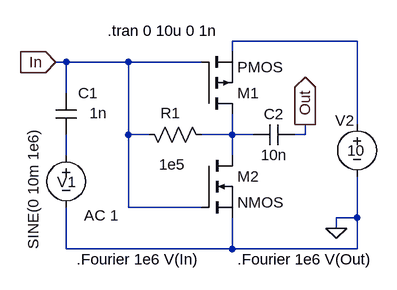
[diagram p0: schematic CmosLinTest_1.asc]
CmosLinTest_1.asc, the LTspice schematic file:
Version 4
SHEET 1 880 680
WIRE -256 80 -272 80
WIRE -256 128 -256 80
WIRE -256 224 -256 192
WIRE -256 368 -256 304
WIRE -160 80 -256 80
WIRE -160 192 -160 80
WIRE -160 304 -160 192
WIRE -128 192 -160 192
WIRE -48 80 -160 80
WIRE -48 304 -160 304
WIRE 0 64 0 48
WIRE 0 192 -48 192
WIRE 0 192 0 160
WIRE 0 224 0 192
WIRE 0 368 -256 368
WIRE 0 368 0 320
WIRE 32 192 0 192
WIRE 112 192 96 192
WIRE 112 192 112 176
WIRE 160 336 160 320
WIRE 192 48 0 48
WIRE 192 176 192 48
WIRE 192 320 160 320
WIRE 192 320 192 256
WIRE 192 368 0 368
WIRE 192 368 192 320
FLAG -272 80 In
IOPIN -272 80 In
FLAG 160 336 0
FLAG 112 176 Out
IOPIN 112 176 Out
SYMBOL res -144 176 M90
WINDOW 0 -2 49 VBottom 0
WINDOW 3 46 51 VTop 0
SYMATTR InstName R1
SYMATTR Value 1e5
SYMATTR SpiceLine tol=1 pwr=0.1
SYMBOL voltage -256 208 M0
WINDOW 0 -15 57 Left 0
WINDOW 3 51 161 VLeft 0
WINDOW 123 -81 108 Left 0
WINDOW 39 0 0 Left 0
SYMATTR InstName V1
SYMATTR Value SINE(0 10m 1e6)
SYMATTR Value2 AC 1
SYMBOL cap -240 128 M0
WINDOW 0 -33 0 Left 0
WINDOW 3 -47 31 Left 0
SYMATTR InstName C1
SYMATTR Value 1n
SYMBOL pmos -48 160 M180
SYMATTR InstName M1
SYMBOL nmos -48 224 R0
SYMATTR InstName M2
SYMBOL voltage 192 160 M0
WINDOW 0 4 10 Left 0
WINDOW 3 15 56 Right 0
WINDOW 123 -67 188 Left 0
WINDOW 39 0 0 Left 0
SYMATTR InstName V2
SYMATTR Value 10
SYMBOL cap 96 176 R90
WINDOW 0 0 32 VBottom 0
WINDOW 3 32 32 VTop 0
SYMATTR InstName C2
SYMATTR Value 10n
TEXT -192 32 Left 0 !.tran 0 10u 0 1n
TEXT -240 384 Left 0 !.Fourier 1e6 V(In)
TEXT 8 384 Left 0 !.Fourier 1e6 V(Out)

The netlist it stands for:
* CmosLinTest_1.asc
R1 In N003 1e5 tol=1 pwr=0.1
V1 N001 0 SINE(0 10m 1e6) AC 1
C1 In N001 1n
M1 N003 In N002 N002 PMOS
M2 N003 In 0 0 NMOS
V2 N002 0 10
C2 Out N003 10n
.model NMOS NMOS
.model PMOS PMOS
.lib standard.mos
.tran 0 10u 0 1n
.Fourier 1e6 V(In)
.Fourier 1e6 V(Out)
.backanno
.end